# Altium schematic sheet ul_rx.SchDoc: Opo4
size Letter; Author: William W. Huang; Organization: Altium Limited; Address1: L3, 12a Rodborough Rd; Address2: Frenchs Forest; Address3: NSW; Address4: Australia 2086; Revision: 1
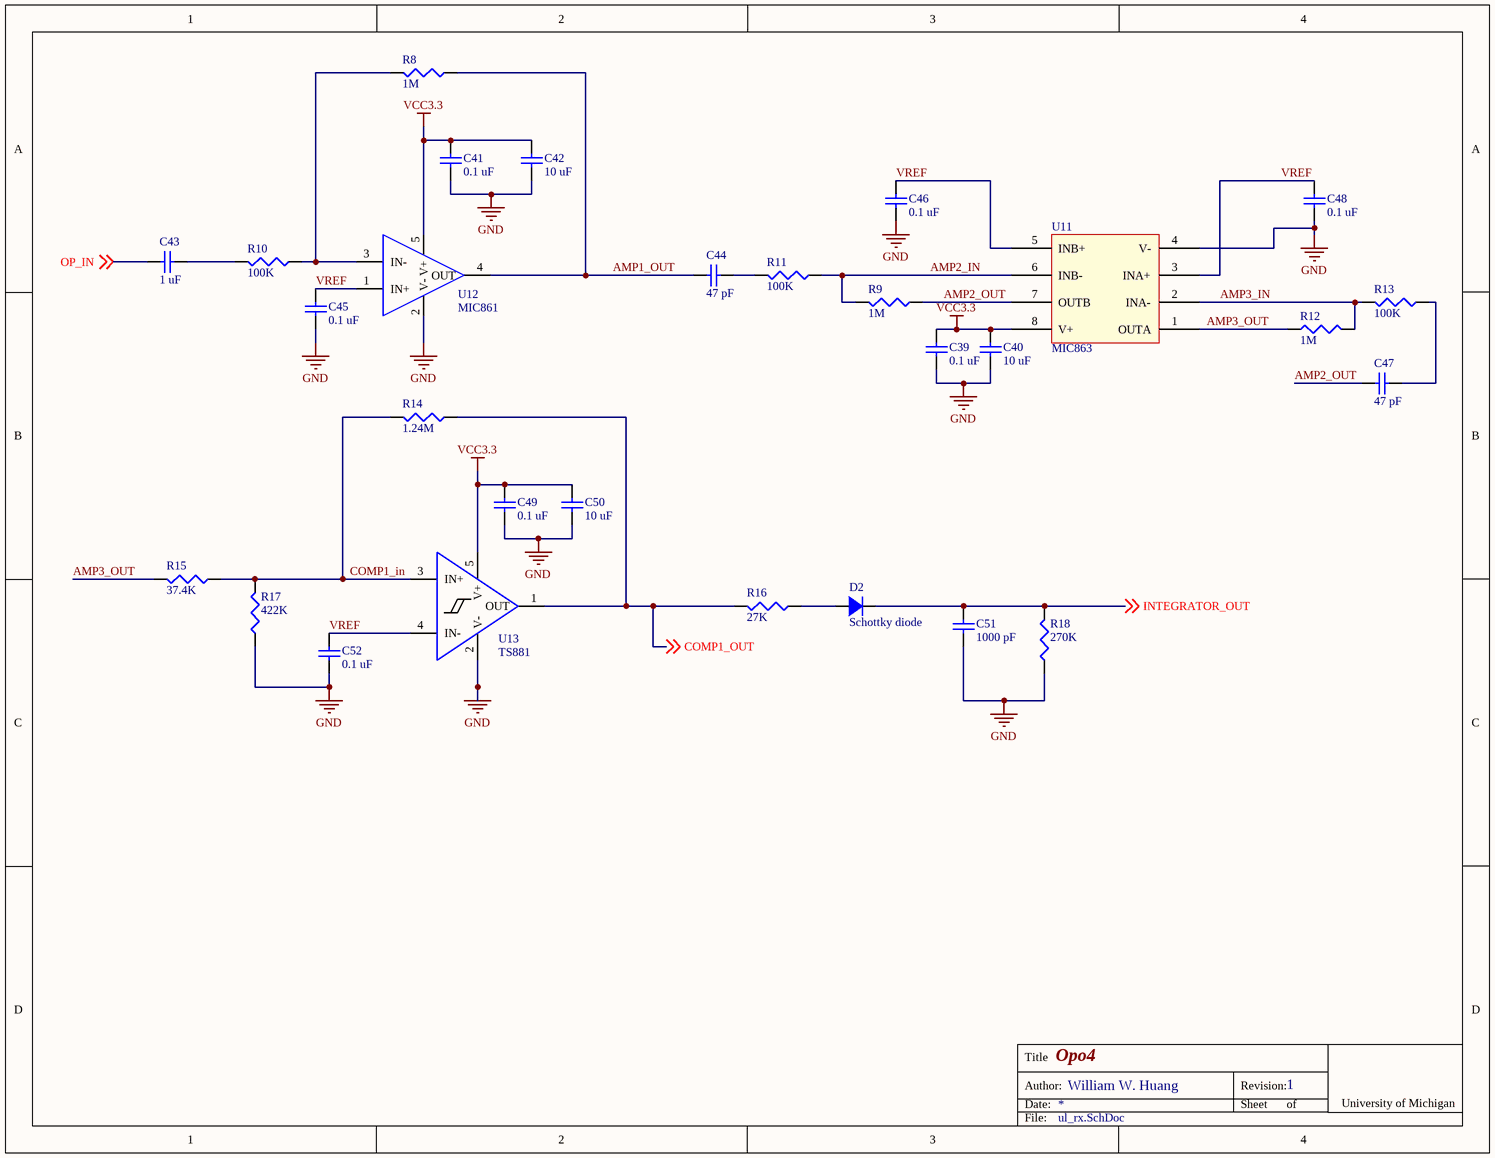
[diagram p0: ul_rx.SchDoc]

## Parts
C39  value 0.1 uF  [0402]  (hidden comment: Ceramic capacitor)
C40  value 10 uF  [0402]  (hidden comment: Ceramic capacitor)
C41  value 0.1 uF  [0402]  (hidden comment: Ceramic capacitor)
C42  value 10 uF  [0402]  (hidden comment: Ceramic capacitor)
C43  value 1 uF  [0402]  (hidden comment: Ceramic capacitor)
C44  value 47 pF  [0402]  (hidden comment: Ceramic capacitor)
C45  value 0.1 uF  [0402]  (hidden comment: Ceramic capacitor)
C46  value 0.1 uF  [0402]  (hidden comment: Ceramic capacitor)
C47  value 47 pF  [0402]  (hidden comment: Ceramic capacitor)
C48  value 0.1 uF  [0402]  (hidden comment: Ceramic capacitor)
C49  value 0.1 uF  [0402]  (hidden comment: Ceramic capacitor)
C50  value 10 uF  [0402]  (hidden comment: Ceramic capacitor)
C51  value 1000 pF  [0402]  (hidden comment: Ceramic capacitor)
C52  value 0.1 uF  [0402]  (hidden comment: Ceramic capacitor)
D2  Schottky diode  [0603 - DIODE]
R8  value 1M  [0402]  (hidden comment: Chip resistor)
R9  value 1M  [0402]  (hidden comment: Chip resistor)
R10  value 100K  [0402]  (hidden comment: Chip resistor)
R11  value 100K  [0402]  (hidden comment: Chip resistor)
R12  value 1M  [0402]  (hidden comment: Chip resistor)
R13  value 100K  [0402]  (hidden comment: Chip resistor)
R14  value 1.24M  [0402]  (hidden comment: Chip resistor)
R15  value 37.4K  [0402]  (hidden comment: Chip resistor)
R16  value 27K  [0402]  (hidden comment: Chip resistor)
R17  value 422K  [0402]  (hidden comment: Chip resistor)
R18  value 270K  [0402]  (hidden comment: Chip resistor)
U11  MIC863  [TSOP65P280X145-8N]
U12  MIC861  [SC70-5]
U13  TS881  [SC70-5]

## Nets
GND: C39.2 C40.2 C41.2 C42.2 C45.2 C46.2 C48.2 C49.2 C50.2 C51.2 C52.2 R17.2 R18.2 U11.4(V-) U12.2(V-) U13.2(V-)
VCC3.3: C39.1 C40.1 C41.1 C42.1 C49.1 C50.1 U11.8(V+) U12.5(V+) U13.5(V+)
AMP1_OUT: C44.1 R8.2 U12.4(OUT)
AMP2_IN: R9.1 R11.2 U11.6(INB-)
AMP2_OUT: C47.1 R9.2 U11.7(OUTB)
AMP3_IN: R12.1 R13.1 U11.2(INA-)
AMP3_OUT: R12.2 R15.1 U11.1(OUTA)
COMP1_in: R14.1 R15.2 R17.1 U13.3(IN+)
COMP1_OUT: R14.2 R16.1 U13.1(OUT) ; off-sheet COMP1_OUT
INTEGRATOR_OUT: C51.1 D2.2 R18.1 ; off-sheet INTEGRATOR_OUT
OP_IN: C43.1 ; off-sheet OP_IN
VREF: C45.1 C46.1 C48.1 C52.1 U11.3(INA+) U11.5(INB+) U12.1(IN+) U13.4(IN-)
NetC43_2: C43.2 R10.1
NetC44_2: C44.2 R11.1
NetC47_2: C47.2 R13.2
NetD2_1: D2.1 R16.2
NetR8_1: R8.1 R10.2 U12.3(IN-)

## Notes on the sheet
- Title
- Date:
- Author:
- Revision:
- Sheet
- of
- University of Michigan
- File:

## Library data of the parts
C39 C41 C45 C46 C48 C49 C52 = C_0.1u_0402_ceramic: Ceramic capacitor, 0.1u, 0402 package; Manufacture: TDK; voltage rated: 10 V; tolerance: 10%; Supplier 1: Digi-Key; Supplier Part Number 1: 445-1265-1-ND; package: 0402
C40 C42 C50 = C_10u_0402_ceramic: Ceramic capacitor, 10 uF, 0402 package; Manufacture: TDK; voltage rated: 4V; tolerance: 20%; package: 0402; Supplier 1: Digi-Key; Supplier Part Number 1: 445-8919-1-ND
C43 = C_1u_0402_ceramic: Ceramic capacitor, 1 uF, 0402 package; Manufacture: TDK; voltage rated: 6.3 V; tolerance: 10%; package: 0402; Supplier 1: Digi-Key; Supplier Part Number 1: 445-5000-1-ND
C44 C47 = C_47p_0402_ceramic: Ceramic capacitor, 47 pF, 0402 package; Manufacture: Johanson; voltage rated: 50 V; tolerance: 5%; package: 0402; Supplier 1: Digi-Key; Supplier Part Number 1: 709-1121-1-ND
C51 = C_1000p_0402_ceramic: Ceramic capacitor, 1000 pF, 0402 package; Manufacture: TDK; voltage rated: 50 V; tolerance: 10%; package: 0402; Supplier 1: Digi-Key; Supplier Part Number 1: 445-6846-1-ND
D2 = D_SCHOTTKY_30V_0.1A_0603: Schottky diode 30 V 0.1 A 0603; package: 0603; Supplier 1: Digi-Key; Supplier Part Number 1: 641-1282-1-ND
R8 R9 R12 = R_1M_0402: Chip resistor, 1M, 0402 package; tolerance: 1%; power: 1/16 W; Supplier 1: Digi-Key; Supplier Part Number 1: 541-1.00MLCT-ND; package: 0402
R10 R11 R13 = R_100K_0402: Chip resistor, 100K, 0402 package; tolerance: 1%; power: 1/16 W; Supplier 1: Digi-Key; Supplier Part Number 1: 541-100KLCT-ND; package: 0402
R14 = R_1.24M_0402: Chip resistor, 1.24M, 0402 package; tolerance: 1%; power: 1/16 W; package: 0402; Supplier 1: Digi-Key; Supplier Part Number 1: 541-1.24MLCT-ND
R15 = R_37.4K_0402: Chip resistor, 37.4K, 0402 package; tolerance: 1%; power: 1/16 W; package: 0402; Supplier 1: Digi-Key; Supplier Part Number 1: 541-37.4KLCT-ND
R16 = R_27K_0402: Chip resistor, 27K, 0402 package; tolerance: 1%; power: 1/16 W; package: 0402; Supplier 1: Digi-Key; Supplier Part Number 1: 541-27.0KLCT-ND
R17 = R_422K_0402: Chip resistor, 422K, 0402 package; tolerance: 1%; power: 1/16 W; package: 0402; Supplier 1: Digi-Key; Supplier Part Number 1: 541-422KLCT-ND
R18 = R_270K_0402: Chip resistor, 270K, 0402 package; tolerance: 1%; power: 1/16 W; package: 0402; Supplier 1: Digi-Key; Supplier Part Number 1: 541-270KLCT-ND
U11 = MIC863: Dual Ultra Low Power Op Amp in SOT23-8; Supplier 1: Digi-Key; Supplier Part Number 1: 576-2934-1-ND
U12 = MIC861: IC OPAMP 400KHZ 2.7V ULT LP SC70; Supplier 1: Digi-Key; Supplier Part Number 1: 576-2932-1-ND
U13 = TS881: Rail-to-rail 1.1 V nanopower comparator; Supplier 1: Digi-Key; Supplier Part Number 1: 497-13217-1-ND